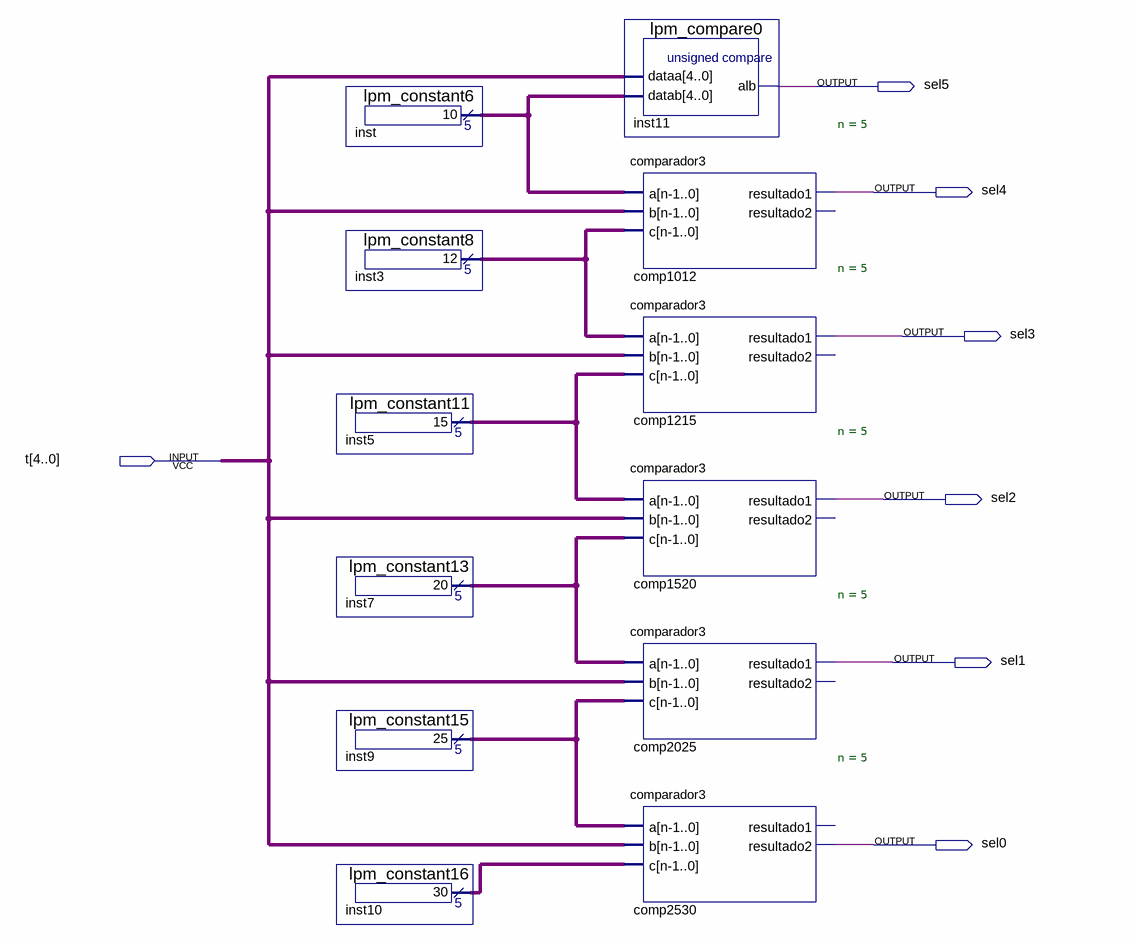
[diagram p0: schematic sheet]
// Quartus schematic timeSelector.bdf as structural Verilog: 12 symbols, 7 pins
module timeSelector (
  input  [4:0] t,
  output sel5,
  output sel4,
  output sel3,
  output sel2,
  output sel1,
  output sel0
);

  wire [4:0] inst3_result, inst5_result, inst7_result, inst9_result, inst10_result, inst_result;

  lpm_constant6 inst (.result(inst_result));
  lpm_constant8 inst3 (.result(inst3_result));
  lpm_constant11 inst5 (.result(inst5_result));
  lpm_constant13 inst7 (.result(inst7_result));
  lpm_constant15 inst9 (.result(inst9_result));
  lpm_constant16 inst10 (.result(inst10_result));
  lpm_compare0 inst11 (.dataa(t), .datab(inst_result), .alb(sel5));
  comparador3 #(.n(5)) comp1012 (.a(inst_result), .b(t), .c(inst3_result), .resultado1(sel4));  // open: resultado2
  comparador3 #(.n(5)) comp1215 (.a(inst3_result), .b(t), .c(inst5_result), .resultado1(sel3));  // open: resultado2
  comparador3 #(.n(5)) comp1520 (.a(inst5_result), .b(t), .c(inst7_result), .resultado1(sel2));  // open: resultado2
  comparador3 #(.n(5)) comp2025 (.a(inst7_result), .b(t), .c(inst9_result), .resultado1(sel1));  // open: resultado2
  comparador3 #(.n(5)) comp2530 (.a(inst9_result), .b(t), .c(inst10_result), .resultado2(sel0));  // open: resultado1
endmodule
